# EAGLE design Final Project IOH (EAGLE 9.6.2)

## Sheet 1 of 2
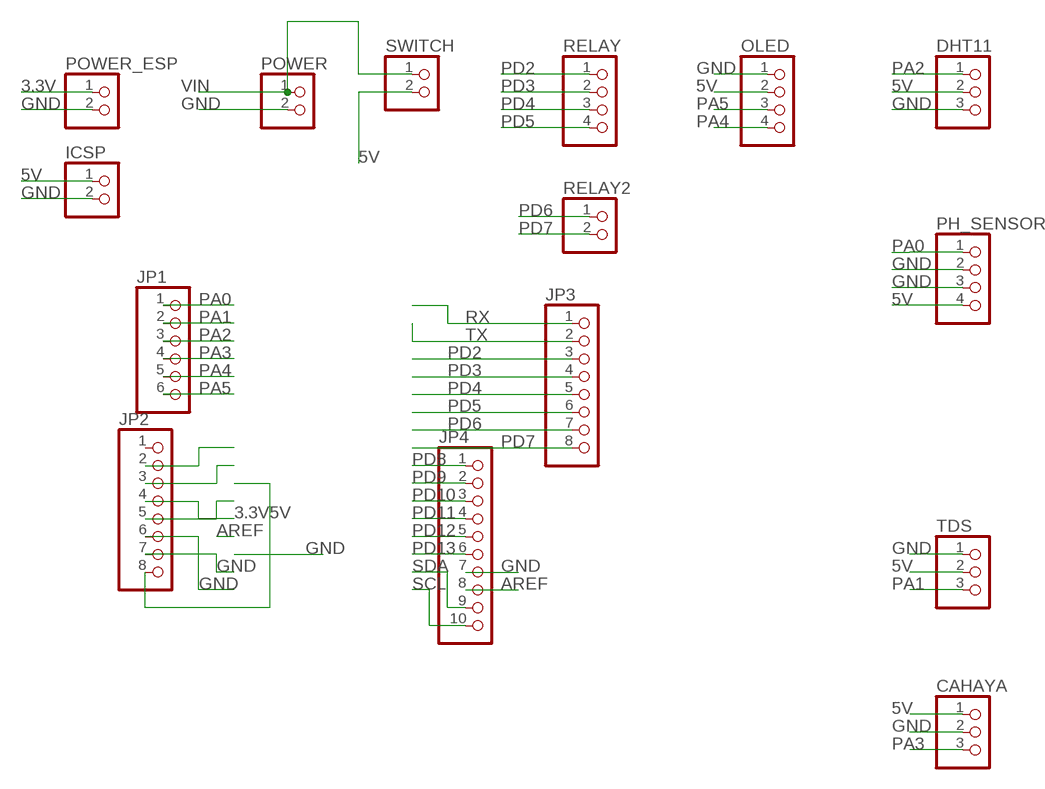
[diagram p0: schematic, sheet 1]

### Parts
CAHAYA  PINHD-1X3  [1X03]
DHT11  PINHD-1X3  [1X03]
ICSP  PINHD-1X2  [1X02]
JP1  PINHD-1X6  [1X06]
JP2  PINHD-1X8  [1X08]
JP3  PINHD-1X8  [1X08]
JP4  PINHD-1X10  [1X10]
OLED  PINHD-1X4  [1X04]
PH_SENSOR  PINHD-1X4  [1X04]
POWER  PINHD-1X2  [1X02]
POWER_ESP  PINHD-1X2  [1X02]
RELAY  PINHD-1X4  [1X04]
RELAY2  PINHD-1X2  [1X02]
SWITCH  PINHD-1X2  [1X02]
TDS  PINHD-1X3  [1X03]

### Nets
3.3V: JP2.4 POWER_ESP.1
5V: CAHAYA.1 DHT11.2 ICSP.1 JP2.8 OLED.2 PH_SENSOR.4 SWITCH.2 TDS.2
AREF: JP4.8
GND: CAHAYA.2 DHT11.3 ICSP.2 JP2.6 JP2.7 JP4.7 OLED.1 PH_SENSOR.2 PH_SENSOR.3 POWER.2 POWER_ESP.2 TDS.1
N$7: JP2.2
N$8: JP2.3
N$10: JP2.5
PA0: JP1.1 PH_SENSOR.1
PA1: JP1.2 TDS.3
PA2: DHT11.1 JP1.3
PA3: CAHAYA.3 JP1.4
PA4: JP1.5 OLED.4
PA5: JP1.6 OLED.3
PD2: JP3.3 RELAY.1
PD3: JP3.4 RELAY.2
PD4: JP3.5 RELAY.3
PD5: JP3.6 RELAY.4
PD6: JP3.7 RELAY2.1
PD7: JP3.8 RELAY2.2
PD8: JP4.1
PD9: JP4.2
PD10: JP4.3
PD11: JP4.4
PD12: JP4.5
PD13: JP4.6
RX: JP3.1
SCL: JP4.10
SDA: JP4.9
TX: JP3.2
VIN: POWER.1 SWITCH.1
Unconnected: JP2.1

## Sheet 2 of 2

## Library data of the parts
CAHAYA DHT11 TDS = pinhead:PINHD-1X3: PIN HEADER
ICSP POWER POWER_ESP RELAY2 SWITCH = pinhead:PINHD-1X2: PIN HEADER
JP1 = pinhead:PINHD-1X6: PIN HEADER
JP2 JP3 = pinhead:PINHD-1X8: PIN HEADER
JP4 = pinhead:PINHD-1X10: PIN HEADER
OLED PH_SENSOR RELAY = pinhead:PINHD-1X4: PIN HEADER

## Board
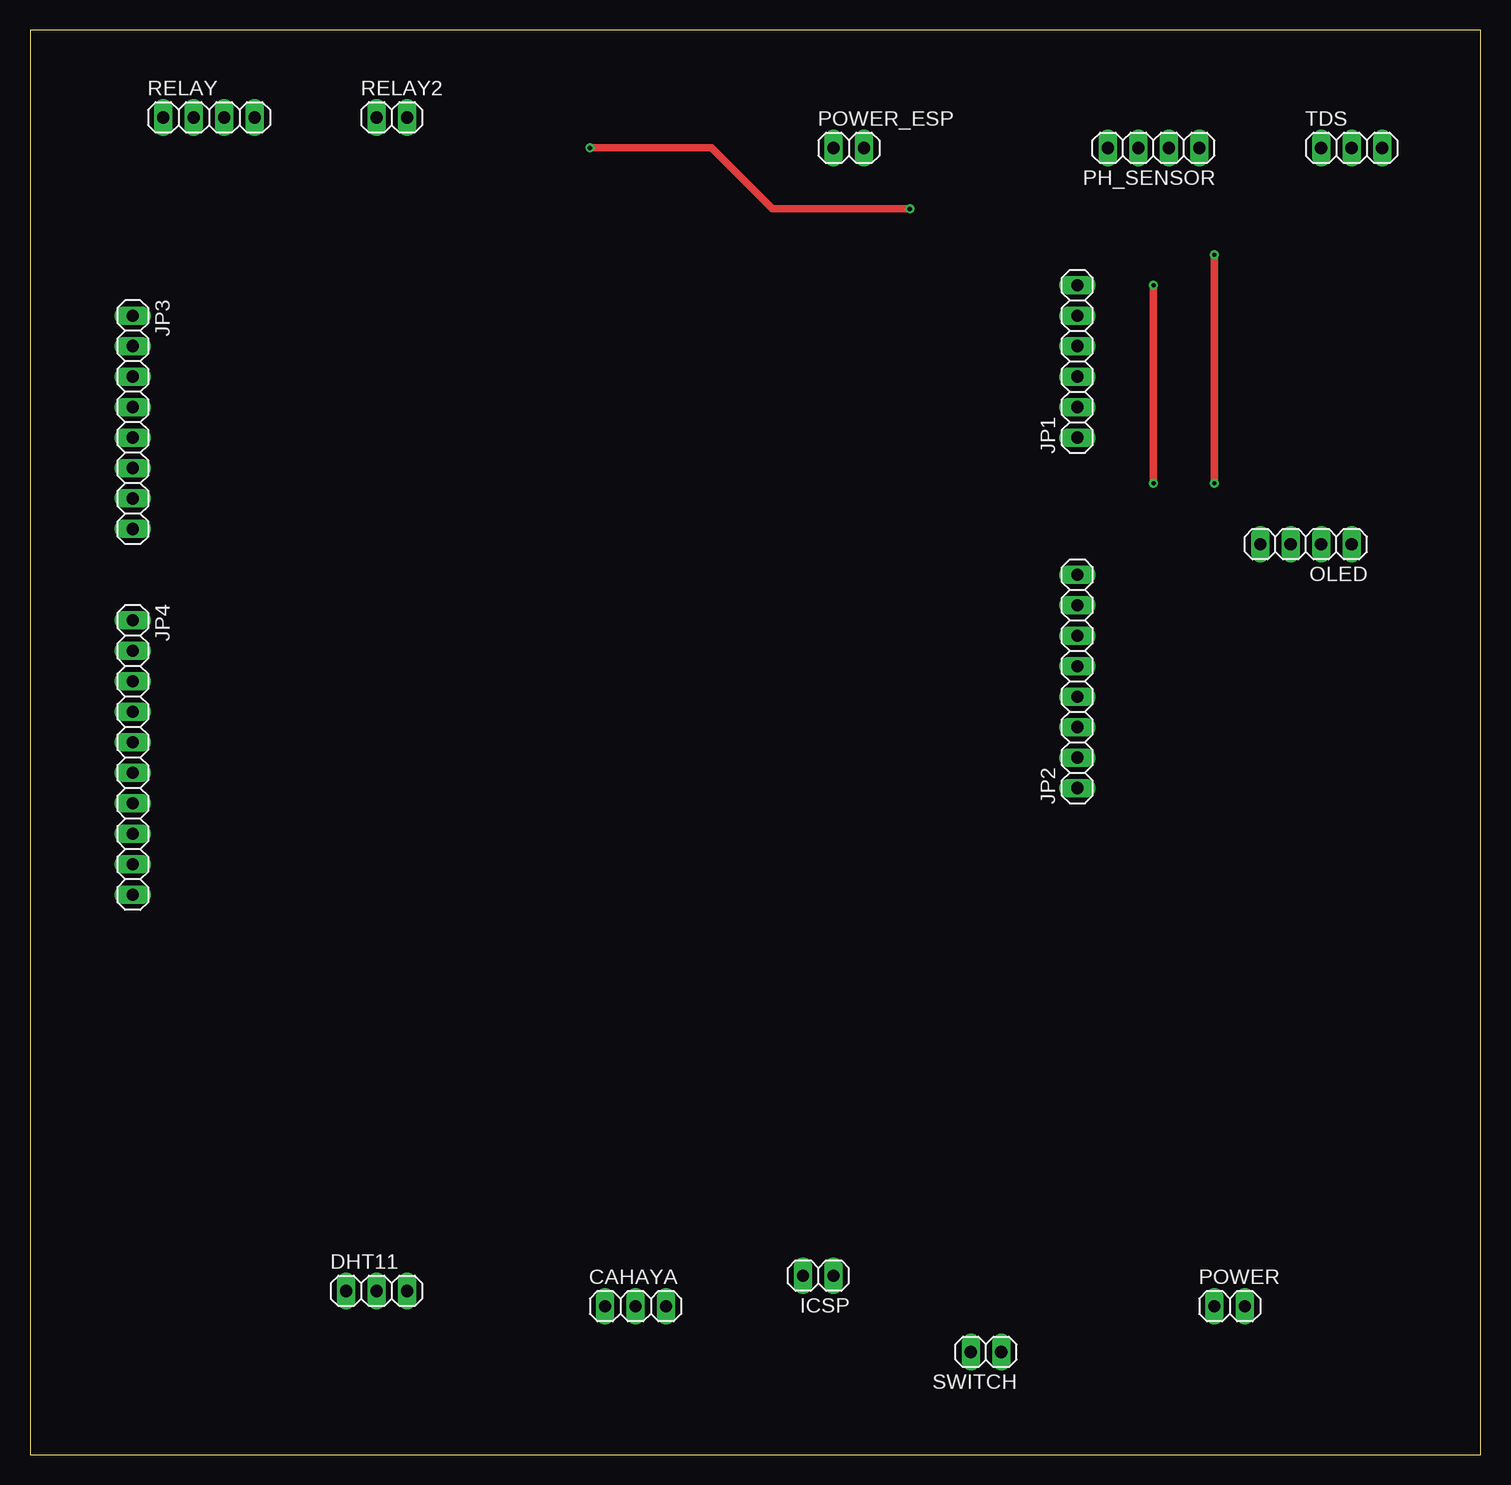
[diagram p1: board, top side]
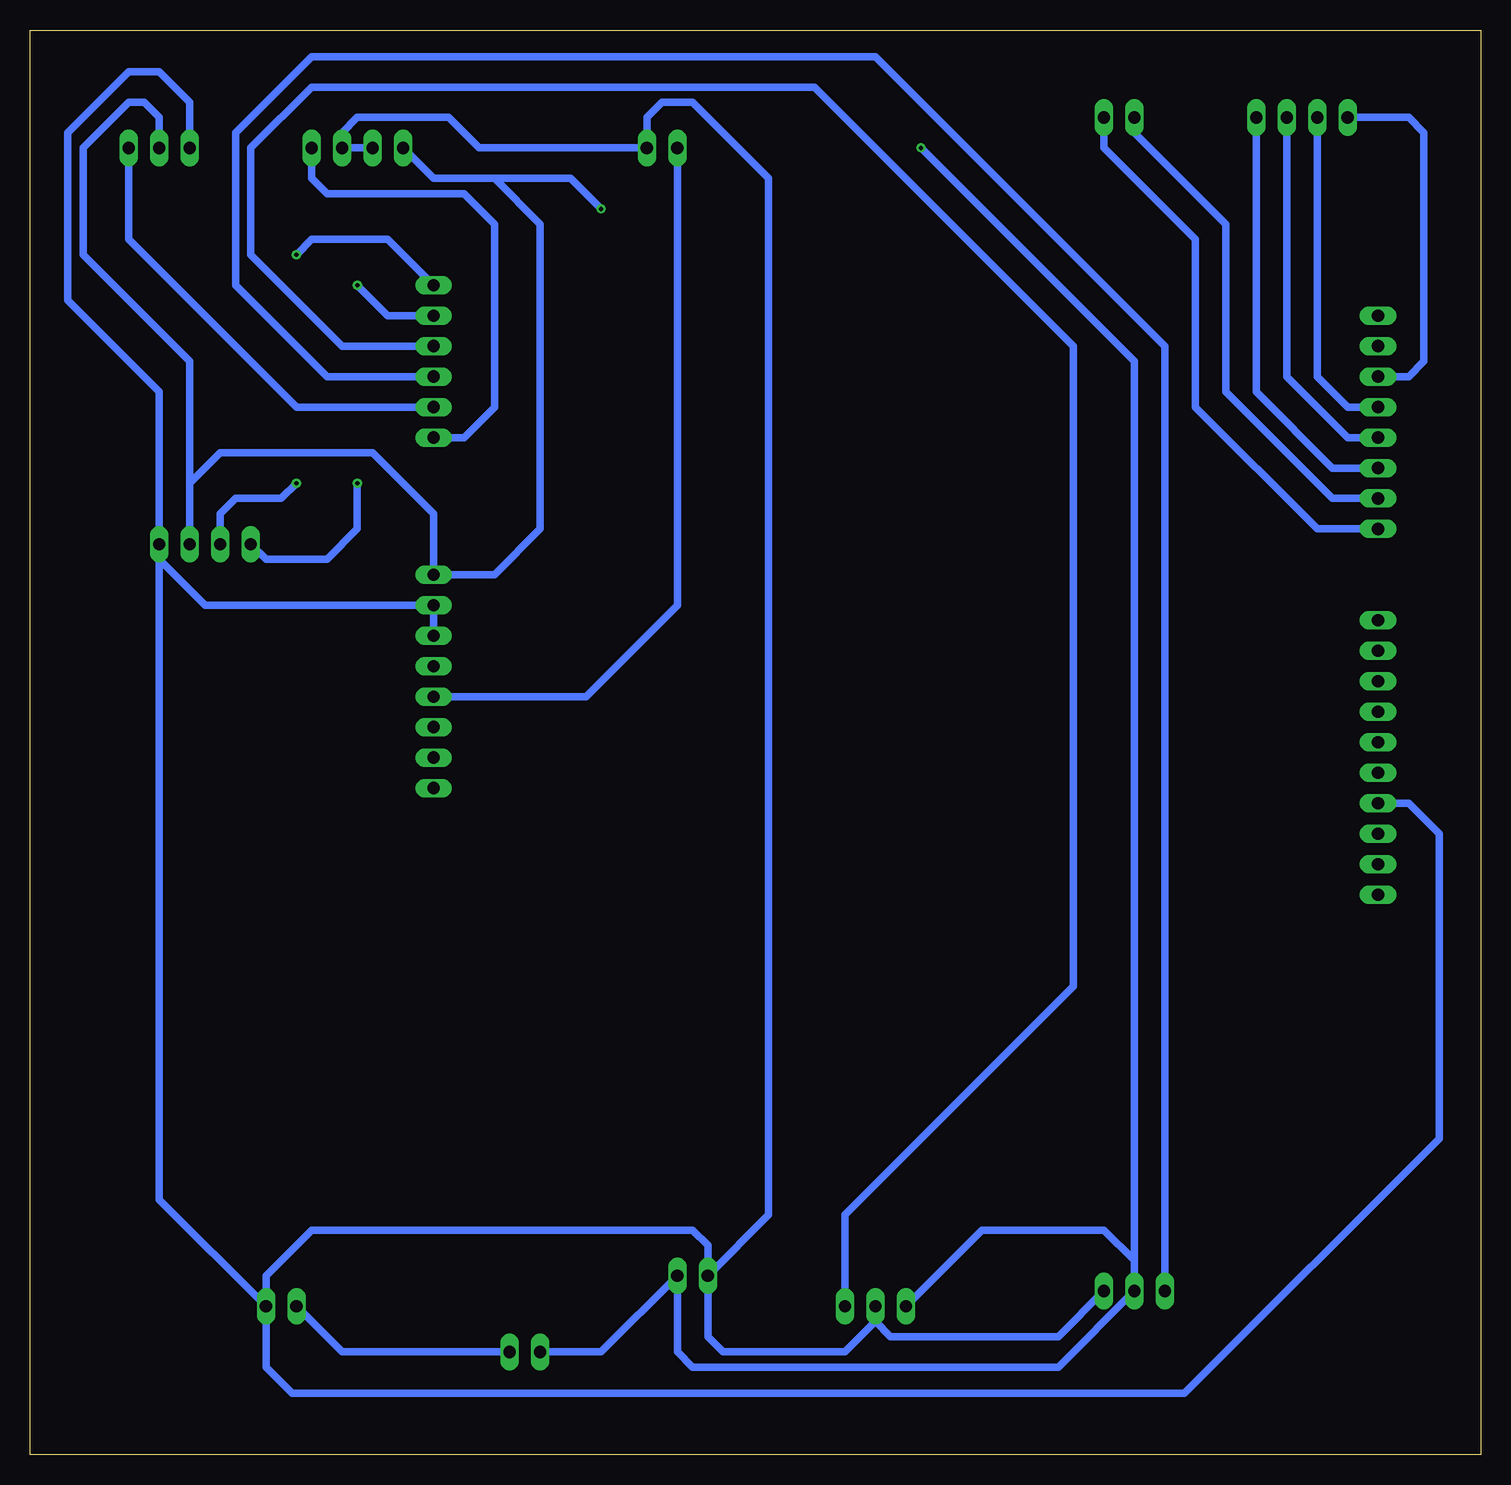
[diagram p2: board, bottom side, seen from below]

Size 120.95 x 118.73 mm. Coordinates in mm from the lower left corner, seen from the top.
Outline: 0,0 120.95,0 120.95,118.73 0,118.73 0,0
Copper layers (1*16): Top 0.035mm / dielectric 1.5mm / Bottom 0.035mm
Design rules "default": minimum track width 6mil, minimum drill 0.35mm, track to track 6mil, track to pad 6mil, pad to pad 6mil, via to via 6mil, smd to smd 6mil, copper to edge 40mil, drill to drill 6mil, minimum pad ring 10mil, minimum via ring 8mil, stop-mask expansion 4mil, vias tented up to drill 0mil, thermal gap 10mil

### Footprints (pad centres in the part's own frame; a part is rotated, then mirrored left to right if it is on the bottom)
1X03 = drill 1.016 long: 1 -2.54,0; 2 0,0; 3 2.54,0
1X02 = drill 1.016 long: 1 -1.27,0; 2 1.27,0
1X06 = drill 1.016 long: 1 -6.35,0; 2 -3.81,0; 3 -1.27,0; 4 1.27,0; 5 3.81,0; 6 6.35,0
1X08 = drill 1.016 long: 1 -8.89,0; 2 -6.35,0; 3 -3.81,0; 4 -1.27,0; 5 1.27,0; 6 3.81,0; 7 6.35,0; 8 8.89,0
1X10 = drill 1.016 long: 1 -11.43,0; 2 -8.89,0; 3 -6.35,0; 4 -3.81,0; 5 -1.27,0; 6 1.27,0; 7 3.81,0; 8 6.35,0; 9 8.89,0; 10 11.43,0
1X04 = drill 1.016 long: 1 -3.81,0; 2 -1.27,0; 3 1.27,0; 4 3.81,0

### Placement (x,y rotation side)
CAHAYA  50.48,12.38 0 top
DHT11  28.89,13.65 0 top
ICSP  65.72,14.92 180 top
JP1  87.31,91.12 90 top
JP2  87.31,64.45 90 top
JP3  8.57,86.04 270 top
JP4  8.57,58.1 270 top
OLED  106.36,75.88 180 top
PH_SENSOR  93.66,108.9 180 top
POWER  100.01,12.38 0 top
POWER_ESP  68.26,108.9 0 top
RELAY  14.92,111.44 0 top
RELAY2  30.16,111.44 0 top
SWITCH  79.69,8.57 180 top
TDS  110.17,108.9 0 top

### Tracks (layer width: path | path; a pad name or v marks a point on that pad's centre or on a via)
3.3V
  Bottom 0.61: POWER_ESP.1 66.99,70.8 74.61,63.18 JP2.4
5V  (via drill 0.35)
  Top 0.61: v46.67,108.9 56.83,108.9 61.91,103.82 v73.34,103.82
  Bottom 0.61: SWITCH.2 73.34,8.57 ICSP.1 66.99,8.57 65.72,7.3 35.24,7.3 DHT11.2 28.89,16.19 | TDS.2 110.17,111.44 111.44,112.71 112.71,112.71 116.52,108.9 116.52,100.01 107.63,91.12 OLED.2 107.63,80.96 105.09,83.5 92.39,83.5 87.31,78.42 JP2.8 82.23,73.34 78.42,77.15 78.42,102.55 82.23,106.36 | PH_SENSOR.4 87.31,106.36 82.23,106.36 | 28.89,16.19 28.89,91.12 v46.67,108.9 | v73.34,103.82 75.88,106.36 82.23,106.36 | 28.89,16.19 31.43,18.73 41.59,18.73 CAHAYA.1
GND
  Bottom 0.61: ICSP.2 64.45,9.84 63.18,8.57 53.02,8.57 50.48,11.11 | ICSP.2 64.45,17.46 65.72,18.73 97.47,18.73 101.28,14.92 POWER.2 | POWER.2 110.17,21.27 110.17,74.61 | 110.17,74.61 OLED.1 110.17,88.58 117.79,96.2 117.79,110.17 112.71,115.25 110.17,115.25 107.63,112.71 TDS.1 | JP2.6 JP2.7 106.36,70.8 110.17,74.61 | PH_SENSOR.3 PH_SENSOR.2 94.93,110.17 93.66,111.44 86.04,111.44 83.5,108.9 POWER_ESP.2 69.53,111.44 68.26,112.71 65.72,112.71 59.37,106.36 59.37,20 ICSP.2 | POWER.2 101.28,7.3 99.11,5.13 24.71,5.13 3.49,26.35 3.49,51.75 6.03,54.29 JP4.7 | DHT11.3 35.24,9.84 49.21,9.84 50.48,11.11 | 50.48,11.11 CAHAYA.2
PA0
  Bottom 0.61: JP1.1 84.77,84.77 82.23,87.31 82.23,102.55 84.77,105.09 96.2,105.09 97.47,106.36 PH_SENSOR.1
PA1
  Bottom 0.61: TDS.3 112.71,101.28 98.74,87.31 JP1.2
PA2
  Bottom 0.61: JP1.3 96.2,89.85 103.82,97.47 103.82,110.17 97.47,116.52 50.48,116.52 26.35,92.39 DHT11.1
PA3
  Bottom 0.61: JP1.4 94.93,92.39 102.55,100.01 102.55,108.9 97.47,113.98 55.56,113.98 33.97,92.39 33.97,39.05 53.02,20 CAHAYA.3
PA4  (via drill 0.35)
  Top 0.61: v93.66,97.47 v93.66,80.96
  Bottom 0.61: OLED.4 101.28,74.61 96.2,74.61 93.66,77.15 v93.66,80.96 | v93.66,97.47 91.12,94.93 JP1.5
PA5  (via drill 0.35)
  Top 0.61: v98.74,80.96 v98.74,100.01
  Bottom 0.61: OLED.3 105.09,78.42 103.82,79.69 100.01,79.69 v98.74,80.96 | v98.74,100.01 97.47,101.28 91.12,101.28 JP1.6
PD2
  Bottom 0.61: RELAY.1 6.03,111.44 4.76,110.17 4.76,91.12 6.03,89.85 JP3.3
PD3
  Bottom 0.61: RELAY.2 13.65,89.85 11.11,87.31 JP3.4
PD4
  Bottom 0.61: RELAY.3 16.19,89.85 11.11,84.77 JP3.5
PD5
  Bottom 0.61: RELAY.4 18.73,88.58 12.38,82.23 JP3.6
PD6
  Bottom 0.61: RELAY2.1 28.89,110.17 21.27,102.55 21.27,88.58 12.38,79.69 JP3.7
PD7
  Bottom 0.61: RELAY2.2 31.43,108.9 23.81,101.28 23.81,87.31 13.65,77.15 JP3.8
VIN
  Bottom 0.61: SWITCH.1 94.93,8.57 POWER.1